# Altium schematic sheet BLUENRG-345_REV1_Sheet3.SchDoc: = Title
size A3; Organization: Altium Limited; Address1: L3, 12a Rodborough Rd; Address2: Frenchs Forest; Address3: NSW; Address4: Australia 2086; SheetNumber: 3; SheetTotal: 3
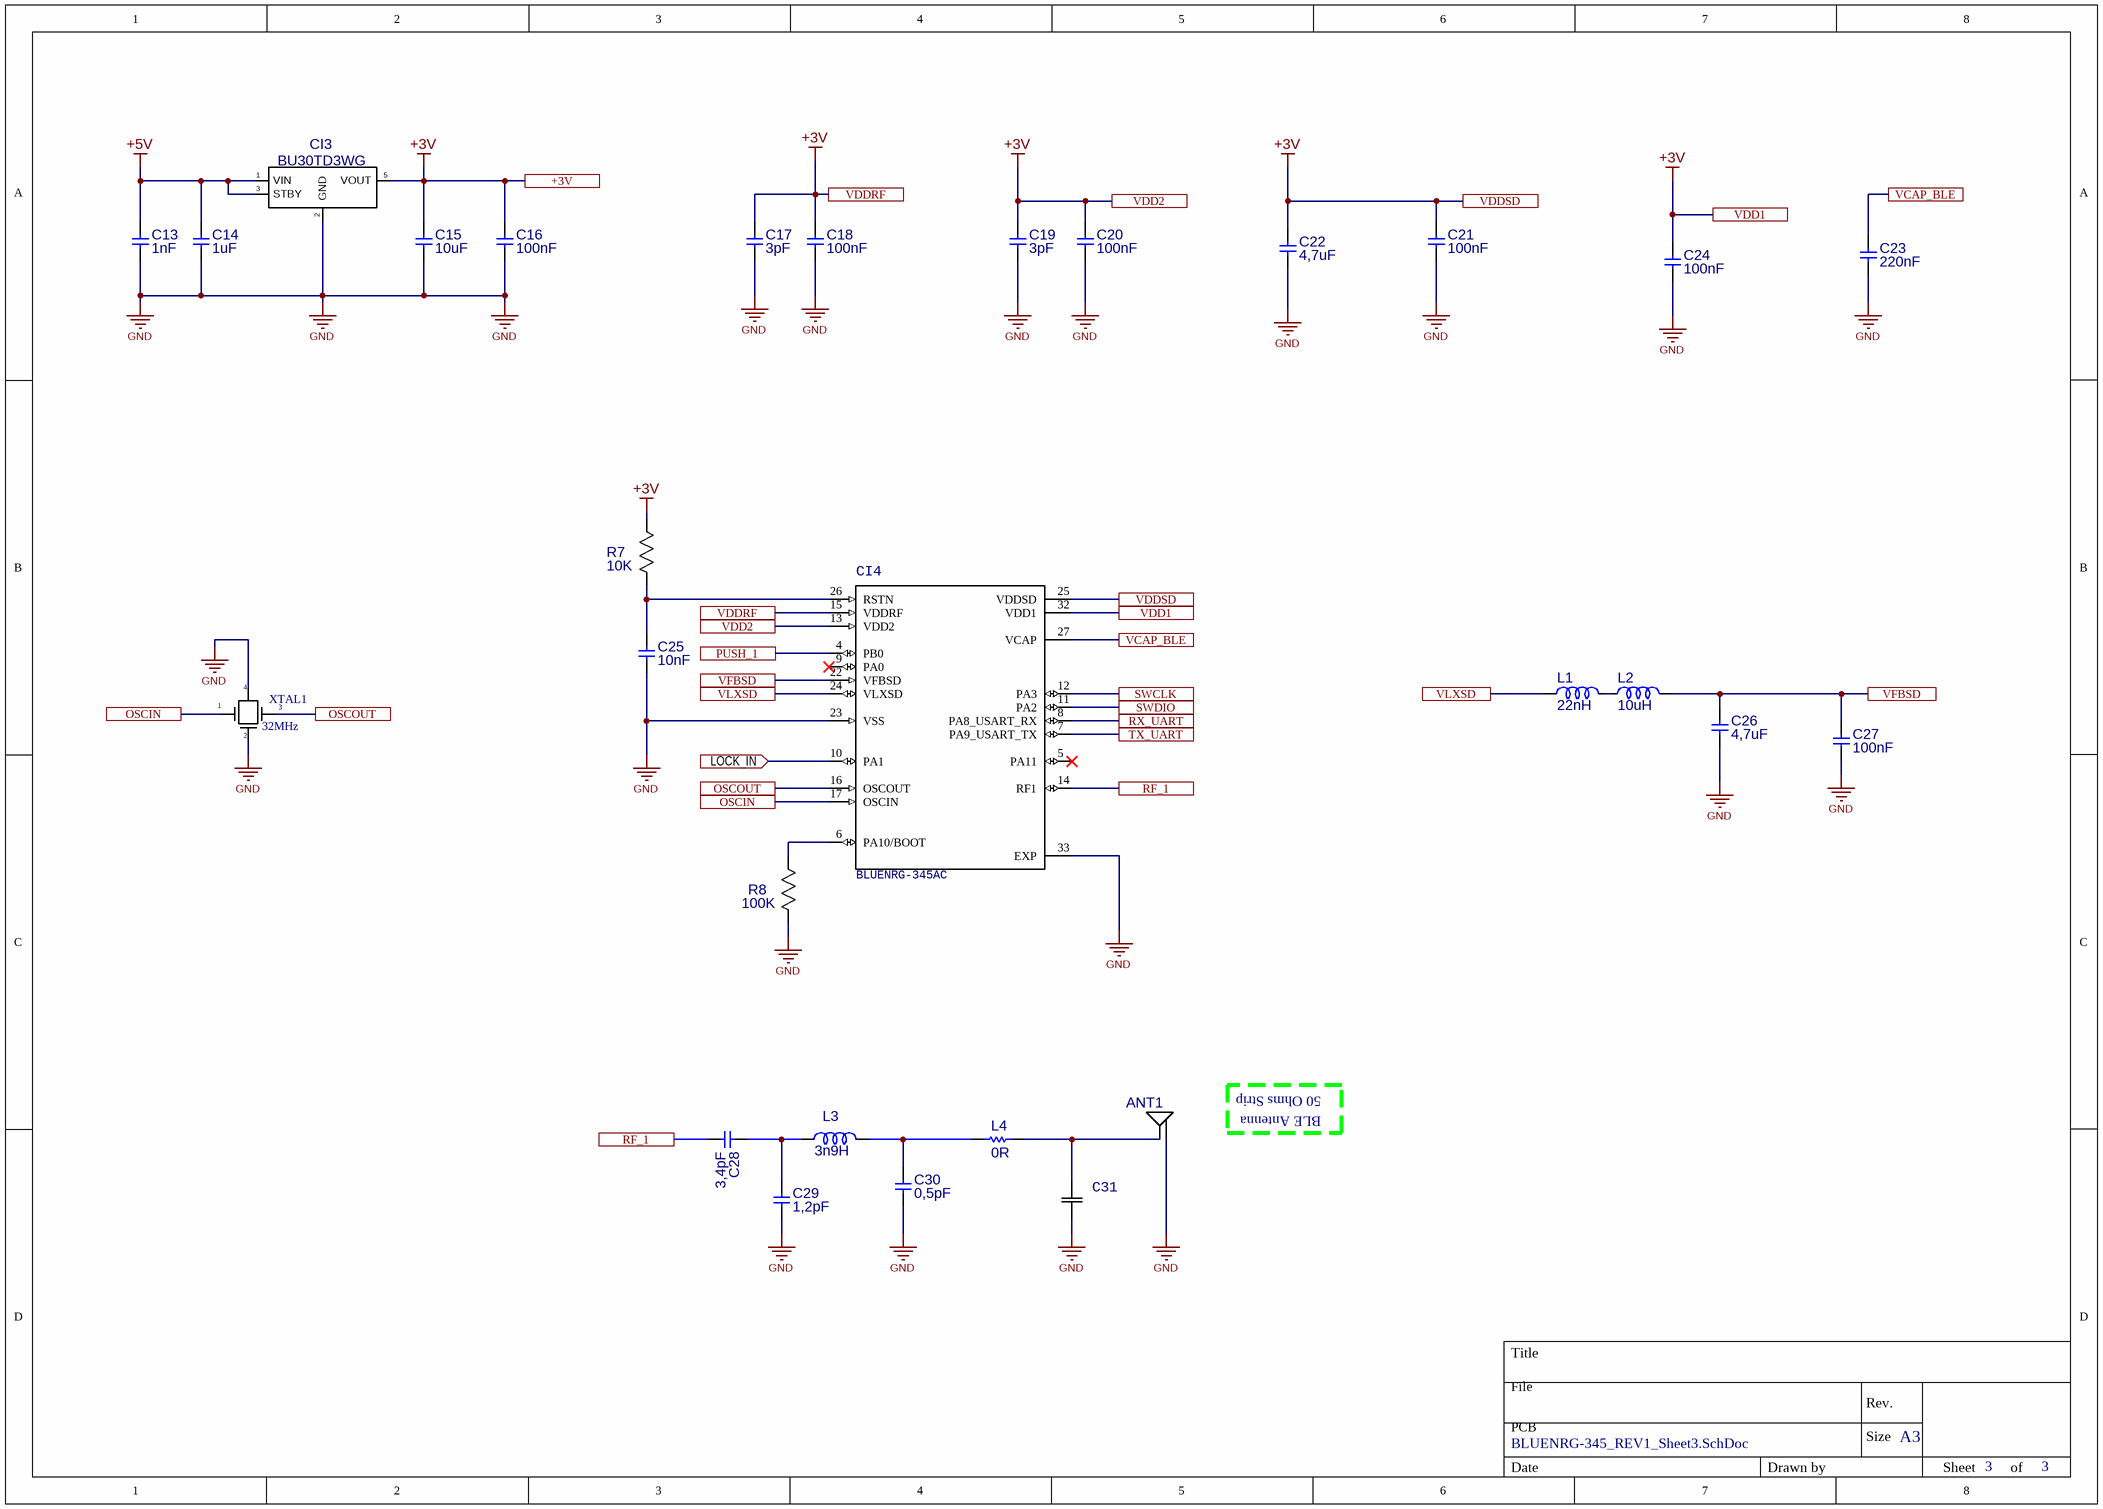
[diagram p0: BLUENRG-345_REV1_Sheet3.SchDoc]

## Parts
ANT1  Antenna_Bluetury  [Antenna_PCB_Bluetury]  (value not drawn)  (net tie, no BOM)
C13  value 1nF  [C0402_REV1]  (hidden comment: C0402)
C14  value 1uF  [C0402_REV1]  (hidden comment: C0402)
C15  value 10uF  [C0402_REV1]  (hidden comment: C0402)
C16  value 100nF  [C0402_REV1]  (hidden comment: C0402)
C17  value 3pF  [C0402_REV1]  (hidden comment: C0402)
C18  value 100nF  [C0402_REV1]  (hidden comment: C0402)
C19  value 3pF  [C0402_REV1]  (hidden comment: C0402)
C20  value 100nF  [C0402_REV1]  (hidden comment: C0402)
C21  value 100nF  [C0402_REV1]  (hidden comment: C0402)
C22  value 4,7uF  [C0402_REV1]  (hidden comment: C0402)
C23  value 220nF  [C0402_REV1]  (hidden comment: C0402)
C24  value 100nF  [C0402_REV1]  (hidden comment: C0402)
C25  value 10nF  [C0402_REV1]  (hidden comment: C0402)
C26  value 4,7uF  [C0402_REV1]  (hidden comment: C0402)
C27  value 100nF  [C0402_REV1]  (hidden comment: C0402)
C28  value 3,4pF  [C0402_REV1]  (hidden comment: C0402)
C29  value 1,2pF  [C0402_REV1]  (hidden comment: C0402)
C30  value 0,5pF  [C0402_REV1]  (hidden comment: C0402)
C31  C0603  [C0402_REV1]  (value not drawn)
CI3  BU30TD3WG  [SOT23-5L]
CI4  BLUENRG-345AC  [QFN33]
L1  value 22nH  [L0402_REV1]  (hidden comment: IND 0402 22nH)
L2  value 10uH  [C0603_REV1]  (hidden comment: IND 0603 10uH)
L3  value 3n9H  [L0402_REV1]  (hidden comment: IND 0402 3n9H)
L4  value 0R  [R0402_REV1]  (hidden comment: RES 0402 0R 1/16W 5%)
R7  value 10K  [R0402_REV1]  (hidden comment: R0402)
R8  value 100K  [R0402_REV1]  (hidden comment: R0402)
XTAL1  value 32MHz  [CX2016DB]  (hidden comment: XTAL_CX2016DB)

## Ports
+3V, LOCK_IN (in), OSCIN, OSCOUT, PUSH_1, RF_1, RX_UART, SWCLK, SWDIO, TX_UART, VCAP_BLE, VDD1, VDD2, VDDRF, VDDSD, VFBSD, VLXSD

## Nets
+3V: C15.2 C16.2(-) C17.2 C18.2(-) C19.2 C20.2(-) C21.2(-) C22.2 C24.2(-) CI3.5(VOUT) CI4.13(VDD2) CI4.15(VDDRF) CI4.25(VDDSD) CI4.32(VDD1) R7.1(A) ; port +3V, port VDDRF, port VDD2, port VDDSD, port VDD1
+5V: C13.2 C14.2 CI3.1(VIN) CI3.3(STBY)
GND: ANT1.2(Feed) C13.1 C14.1 C15.1 C16.1(+) C17.1 C18.1(+) C19.1 C20.1(+) C21.1(+) C22.1 C23.1 C24.1(+) C25.1 C26.1 C27.1(+) C29.1 C30.1 C31.2 CI3.2(GND) CI4.23(VSS) CI4.33(EXP) R8.2(B) XTAL1.2 XTAL1.4
LOCK_IN: CI4.10(PA1) ; port LOCK_IN
OSCIN: CI4.17(OSCIN) XTAL1.1 ; port OSCIN
OSCOUT: CI4.16(OSCOUT) XTAL1.3 ; port OSCOUT
PUSH_1: CI4.4(PB0) ; port PUSH_1
RF_1: C28.1 CI4.14(RF1) ; port RF_1
RX_UART: CI4.8(PA8_USART_RX) ; port RX_UART
SWCLK: CI4.12(PA3) ; port SWCLK
SWDIO: CI4.11(PA2) ; port SWDIO
TX_UART: CI4.7(PA9_USART_TX) ; port TX_UART
VCAP_BLE: C23.2 CI4.27(VCAP) ; port VCAP_BLE
VFBSD: C26.2 C27.2(-) CI4.22(VFBSD) L2.2 ; port VFBSD
VLXSD: CI4.24(VLXSD) L1.1 ; port VLXSD
NetANT1_1: ANT1.1(Feed) C31.1 L4.1
NetC25_2: C25.2 CI4.26(RSTN) R7.2(B)
NetC28_2: C28.2 C29.2 L3.1
NetC30_2: C30.2 L3.2 L4.2
NetCI4_6: CI4.6(PA10/BOOT) R8.1(A)
NetL1_2: L1.2 L2.1

Not connected (* = marked no-connect by the designer): CI3 4(NC); CI4 5(PA11)* 9(PA0)*

## Notes on the sheet
- 50 Ohms Strip
- BLE Antenna
- Title
- File
- PCB
- Rev.
- Size
- A3
- Date
- Drawn by
- Sheet
- of

## Library data of the parts
ANT1 = ANT_Bluetury: PCB ANTENNA; Código Tury: AMOSTRA; Tipo de Montagem: SMD
C13 = CAP_0402 1nF 5% 50V X7R: CAPACITOR 0402 1NF / 50V C0G 5%; Partnumber Fabricante 01: GRT1555C1H102JA02D; Código Tury: 002.00.00004; Tipo de Montagem: SMD; Fabricante 01: MURATA; Fabricante 02: SAMSUNGEM; Fabricante 03: YAGEO; Partnumber Fabricante 02: CL05B102KB5NNNC; Partnumber Fabricante 03: CC0402JRNP09BN102
C14 = CAP_0402 1uF 10% 16V X6S: CAPACITOR 0402 1UF / 16V X6S 10%; Partnumber Fabricante 01: EMK105C6105KV-F; Código Tury: 002.00.00009; Tipo de Montagem: SMD; Fabricante 01: TAIYO-YUDEN; Fabricante 02: YAGEO; Fabricante 03: TDK; Partnumber Fabricante 02: CC0402KRX6S7BB105; Partnumber Fabricante 03: C1005X6S1C105K050BC
C15 = CAP_0402 10uF 20% 6V3 X6S: CAPACITOR 0402 10UF / 6.3V X6S 20%; Partnumber Fabricante 01: GRM155C80J106ME11D; Código Tury: 002.00.00010; Encapsulamento: 0402; Tipo de Montagem: SMD; Fabricante 01: MURATA
C16 C18 C20 C21 C24 C27 = CAP_0402 100nF 10% 50V X7R: CAPACITOR 0402 100NF / 50V X7R 10%; Partnumber Fabricante 01: GCM155R71H104KE02D; Código Tury: 002.00.00015; Tipo de Montagem: SMD; Fabricante 01: MURATA; Fabricante 02: YAGEO; Partnumber Fabricante 02: CC0402KRX5R9BB104
C17 C19 = CAP_0402 3pF 10% 25V C0G: CAPACITOR 0402 3pF / 25V C0G; Partnumber Fabricante 01: VJ0402D3R0BXCAJ; Código Tury: 002.00.00024; Tipo de Montagem: SMD; Fabricante 01: VISHAY; Fabricante 02: KEMET
C22 C26 = CAP_0402 4,7uF 10% 50V X7R1: CAPACITOR 0402 4,7uF / 50V X7R 10%; Código Tury: 002.00.00022; Tipo de Montagem: SMD
C23 = CAP_0402 220nF 10% 16V X7R: CAPACITOR 0402 220NF / 16V X7R 10%; Partnumber Fabricante 01: GRM155R71H224KA12D; Código Tury: 002.00.00014; Tipo de Montagem: SMD; Fabricante 01: MURATA; Fabricante 02: YAGEO; Fabricante 03: TAIYO-YUDEN; Partnumber Fabricante 02: CC0402KRX7R8BB224; Partnumber Fabricante 03: UMK105BJ224KV-F
C25 = CAP_0402 10nF 5% 25V X7R: CAPACITOR 0402 10NF / 25V X7R 5%; Partnumber Fabricante 01: GRM155R71E103JA01J; Código Tury: 002.00.00007; Tipo de Montagem: SMD; Fabricante 01: MURATA; Fabricante 02: YAGEO; Fabricante 03: YAGEO; Partnumber Fabricante 02: CC0402KRX7R8BB103; Partnumber Fabricante 03: CC0402JRX7R8BB103
C28 = CAP_0402 3,4pF 10% 25V C0G_: CAPACITOR 0402 3,4pF / 25V C0G; Partnumber Fabricante 01: GRM1555C1E3R4BA01D; Código Tury: 002.00.00026; Tipo de Montagem: SMD; Fabricante 01: MURATA
C29 = CAP_0402 1,2pF 10% 25V C0G: CAPACITOR 0402 1,2pF / 25V C0G; Partnumber Fabricante 01: VJ0402A1R2BXXCW1BC; Código Tury: 002.00.00025; Tipo de Montagem: SMD; Fabricante 01: Vishay; Fabricante 02: KYOCERA AVX; Partnumber Fabricante 02: 04023J1R2ABSTR
C30 = CAP_0402 0,5pF 5% 50V C0G: CAPACITOR 0402 0,5PF / 50V C0G 5%; Partnumber Fabricante 01: CC0402BRNPO9BNR50; Código Tury: 002.00.00023; Tipo de Montagem: SMD; Fabricante 01: Yageo; Fabricante 02: KEMET; Partnumber Fabricante 02: C0402C508C5GACTU
C31 = C0603: Capacitor
CI3 = CI_BU30TD3WG_SSOP5: CI ANALÓGICO REG DE TENSÃO  BU30TD3WG SSOP5; Código Tury: 004.02.00014; Tipo de Montagem: SMD; Fabricante 01: ROHM; Encapsulamento: SSOP5; Partnumber Fabricante 01: BU30TD3WG
CI4 = CI_BLUENRG-345: CI MICROCOTROLADOR BLUENRG-345AC; Código Tury: 004.07.00052; Value: BLUENRG-345AC
L1 = IND 0402 22nH: MICRO INDUTOR SMD 0402 22nH; Partnumber Fabricante 01: LQG15WH22NH02D; Código Tury: 003.02.00015; Encapsulamento: 0402; Fabricante 01: MURATA; Tipo de Montagem: SMD
L2 = IND 0603 10uH: MICRO INDUTOR  SMD 0603 10uH; Partnumber Fabricante 01: MLZ1608N100LT000; Encapsulamento: 0603; Código Tury: 003.02.00010; Fabricante 01: TDK; Tipo de Montagem: SMD
L3 = IND 0402 3n9H: MICRO INDUTOR SMD 0402 3,9nH; Partnumber Fabricante 01: LQG15HS3N9S02D; Código Tury: 003.02.00007; Encapsulamento: 0402; Fabricante 01: MURATA; Tipo de Montagem: SMD
L4 = RES 0402 0R 1/16W 5%: RESISTOR 0402 0R 1/16W 5%; Partnumber Fabricante 01: RC0402JR-070RL; Código Tury: 001.00.00024; Encapsulamento: 0402; Tipo de Montagem: SMD; Fabricante 01: YAGEO; Fabricante 02: WALSIN; Partnumber Fabricante 02: MR04X000PTL
R7 = RES 0402 10K 1/16W 5%: RESISTOR 0402 10K 1/16W 5%; Partnumber Fabricante 01: CRCW040210K0JNED; Código Tury: 001.00.00007; Encapsulamento: 0402; Tipo de Montagem: SMD; Fabricante 01: VISHAY; Fabricante 02: VIKING; Fabricante 03: WALSIN; Partnumber Fabricante 02: CR-02JL6---10K; Partnumber Fabricante 03: WR04X103JTL
R8 = RES 0402 100K 1/16W 5%: RESISTOR 0402 100K 1/16W 5%; Partnumber Fabricante 01: CRCW0402100KJNED; Código Tury: 001.00.00005; Encapsulamento: 0402; Tipo de Montagem: SMD; Fabricante 01: VISHAY; Fabricante 02: VIKING; Fabricante 03: WALSIN; Partnumber Fabricante 02: CR-02JL6--100K; Partnumber Fabricante 03: WR04X104JTL
XTAL1 = XTAL_CX2016DB: CRISTAL OSCILADOR 32MHZ SMD; Partnumber Fabricante 01: CX2016DB32000H0WRRC1; Código Tury: 009.01.00012; Fabricante 01: AVX; Fabricante 02: KYOCERA; Tipo de Montagem: SMD; Partnumber Fabricante 02: CX2016DB32000H0FLJC1; Encapsulamento: CX2016DB